# EAGLE design triaki samodzielne mniejsze_ver.4 (EAGLE 7.6.0)
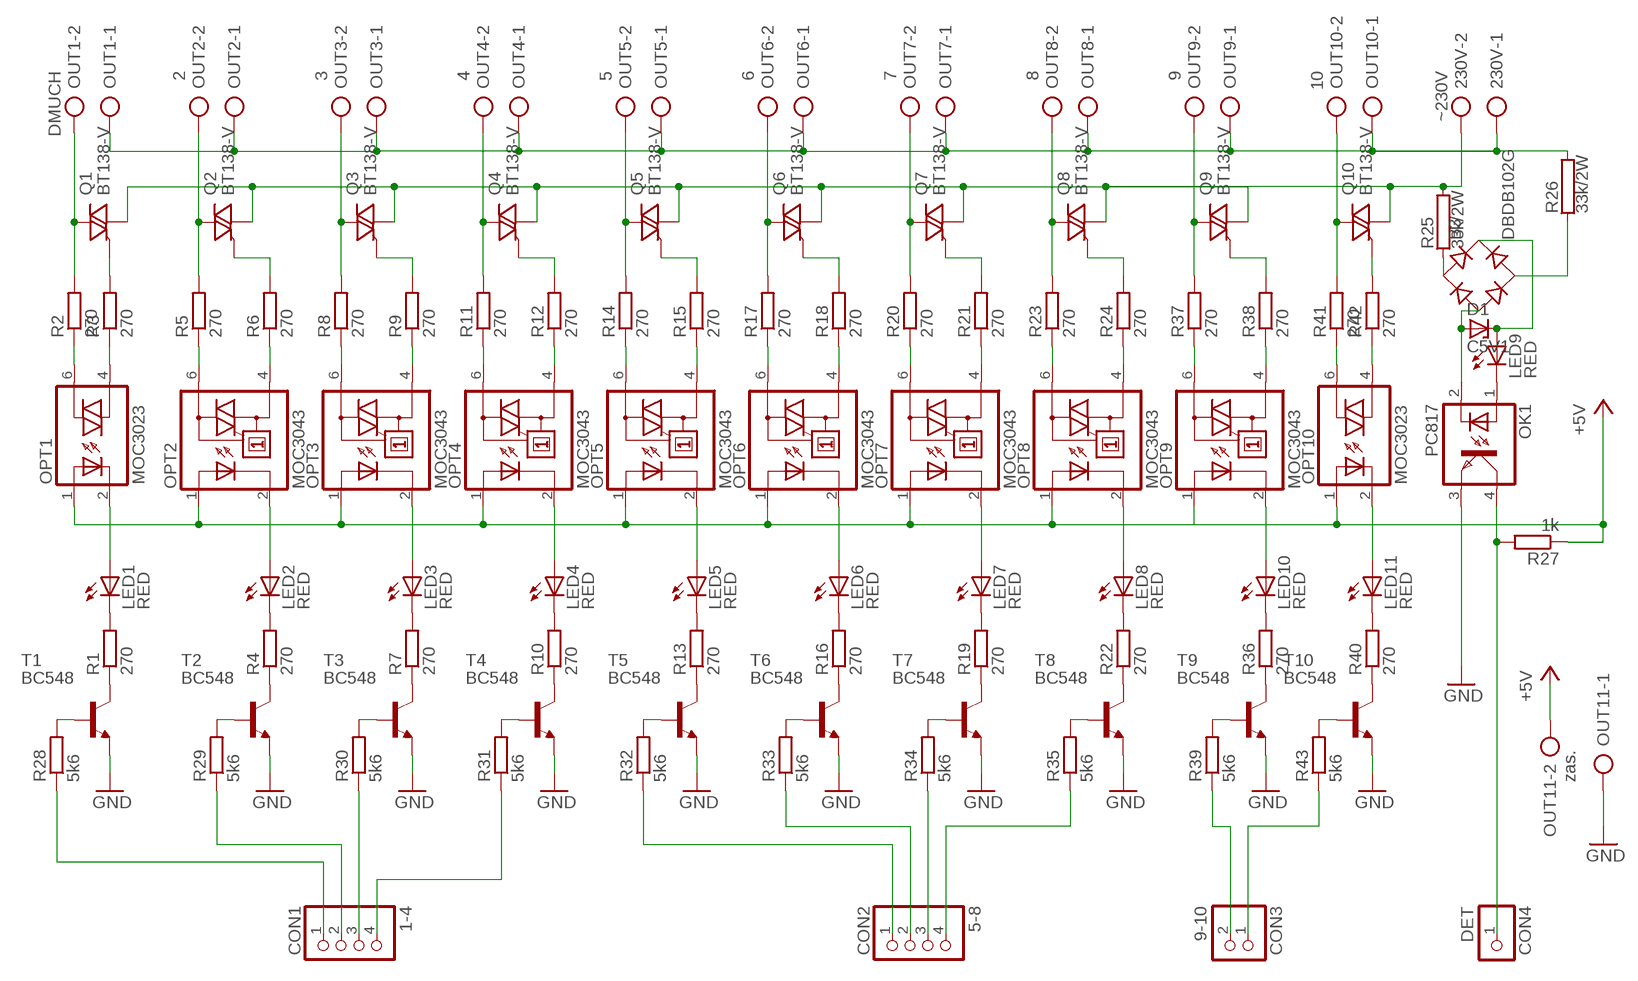
[diagram p0: schematic, sheet 1]

## Parts
230V  ~230V  AK500/2  [AK500/2]
B3  DBDB102G  [DB]
CON1  1-4  PINHD-1X4  [1X04]
CON2  5-8  PINHD-1X4  [1X04]
CON3  9-10  PINHD-1X2  [1X02]
CON4  DET  PINHD-1X1  [1X01]
D1  C5V1  BZX55  [DO35Z10]
LED1  RED  LED3MM  [LED3MM]
LED2  RED  LED3MM  [LED3MM]
LED3  RED  LED3MM  [LED3MM]
LED4  RED  LED3MM  [LED3MM]
LED5  RED  LED3MM  [LED3MM]
LED6  RED  LED3MM  [LED3MM]
LED7  RED  LED3MM  [LED3MM]
LED8  RED  LED3MM  [LED3MM]
LED9  RED  LED3MM  [LED3MM]
LED10  RED  LED3MM  [LED3MM]
LED11  RED  LED3MM  [LED3MM]
OK1  PC817  [DIL04]
OPT1  MOC3023  IL420  [DIL06]
OPT2  MOC3043  IL410  [DIL06]
OPT3  MOC3043  IL410  [DIL06]
OPT4  MOC3043  IL410  [DIL06]
OPT5  MOC3043  IL410  [DIL06]
OPT6  MOC3043  IL410  [DIL06]
OPT7  MOC3043  IL410  [DIL06]
OPT8  MOC3043  IL410  [DIL06]
OPT9  MOC3043  IL410  [DIL06]
OPT10  MOC3023  IL420  [DIL06]
OUT1  DMUCH  AK500/2  [AK500/2]
OUT2  2  AK500/2  [AK500/2]
OUT3  3  AK500/2  [AK500/2]
OUT4  4  AK500/2  [AK500/2]
OUT5  5  AK500/2  [AK500/2]
OUT6  6  AK500/2  [AK500/2]
OUT7  7  AK500/2  [AK500/2]
OUT8  8  AK500/2  [AK500/2]
OUT9  9  AK500/2  [AK500/2]
OUT10  10  AK500/2  [AK500/2]
OUT11  zas.  AK500/2  [AK500/2]
Q1  BT138-V  [TO220BV]
Q2  BT138-V  [TO220BV]
Q3  BT138-V  [TO220BV]
Q4  BT138-V  [TO220BV]
Q5  BT138-V  [TO220BV]
Q6  BT138-V  [TO220BV]
Q7  BT138-V  [TO220BV]
Q8  BT138-V  [TO220BV]
Q9  BT138-V  [TO220BV]
Q10  BT138-V  [TO220BV]
R1  270  R-EU_0204/7  [0204/7]
R2  270  R-EU_0204/7  [0204/7]
R3  270  R-EU_0204/7  [0204/7]
R4  270  R-EU_0204/7  [0204/7]
R5  270  R-EU_0204/7  [0204/7]
R6  270  R-EU_0204/7  [0204/7]
R7  270  R-EU_0204/7  [0204/7]
R8  270  R-EU_0204/7  [0204/7]
R9  270  R-EU_0204/7  [0204/7]
R10  270  R-EU_0204/7  [0204/7]
R11  270  R-EU_0204/7  [0204/7]
R12  270  R-EU_0204/7  [0204/7]
R13  270  R-EU_0204/7  [0204/7]
R14  270  R-EU_0204/7  [0204/7]
R15  270  R-EU_0204/7  [0204/7]
R16  270  R-EU_0204/7  [0204/7]
R17  270  R-EU_0204/7  [0204/7]
R18  270  R-EU_0204/7  [0204/7]
R19  270  R-EU_0204/7  [0204/7]
R20  270  R-EU_0204/7  [0204/7]
R21  270  R-EU_0204/7  [0204/7]
R22  270  R-EU_0204/7  [0204/7]
R23  270  R-EU_0204/7  [0204/7]
R24  270  R-EU_0204/7  [0204/7]
R25  33k/2W  RAC01  [AC01]
R26  33k/2W  RAC01  [AC01]
R27  1k  R-EU_0204/7  [0204/7]
R28  5k6  R-EU_0204/7  [0204/7]
R29  5k6  R-EU_0204/7  [0204/7]
R30  5k6  R-EU_0204/7  [0204/7]
R31  5k6  R-EU_0204/7  [0204/7]
R32  5k6  R-EU_0204/7  [0204/7]
R33  5k6  R-EU_0204/7  [0204/7]
R34  5k6  R-EU_0204/7  [0204/7]
R35  5k6  R-EU_0204/7  [0204/7]
R36  270  R-EU_0204/7  [0204/7]
R37  270  R-EU_0204/7  [0204/7]
R38  270  R-EU_0204/7  [0204/7]
R39  5k6  R-EU_0204/7  [0204/7]
R40  270  R-EU_0204/7  [0204/7]
R41  270  R-EU_0204/7  [0204/7]
R42  270  R-EU_0204/7  [0204/7]
R43  5k6  R-EU_0204/7  [0204/7]
T1  BC548  BC548-NPN-TO92-CBE  [TO92-CBE]
T2  BC548  BC548-NPN-TO92-CBE  [TO92-CBE]
T3  BC548  BC548-NPN-TO92-CBE  [TO92-CBE]
T4  BC548  BC548-NPN-TO92-CBE  [TO92-CBE]
T5  BC548  BC548-NPN-TO92-CBE  [TO92-CBE]
T6  BC548  BC548-NPN-TO92-CBE  [TO92-CBE]
T7  BC548  BC548-NPN-TO92-CBE  [TO92-CBE]
T8  BC548  BC548-NPN-TO92-CBE  [TO92-CBE]
T9  BC548  BC548-NPN-TO92-CBE  [TO92-CBE]
T10  BC548  BC548-NPN-TO92-CBE  [TO92-CBE]

## Nets
+5V: OPT1.1(A) OPT2.1(A) OPT3.1(A) OPT4.1(A) OPT5.1(A) OPT6.1(A) OPT7.1(A) OPT8.1(A) OPT10.1(A) OUT11.2 R27.1
+5V1: OPT9.1(A)
GND: OK1.3(EMIT) OUT11.1 T1.E T2.E T3.E T4.E T5.E T6.E T7.E T8.E T9.E T10.E
N$1: OPT1.6(A2) R2.1
N$2: OPT1.4(A1) R3.1
N$3: LED1.K(C) R1.2
N$4: LED1.A OPT1.2(C)
N$5: Q1.G R3.2
N$6: OUT1.2 Q1.T2(A2) R2.2
N$7: LED2.K(C) R4.2
N$8: OPT2.6(A2) R5.1
N$10: Q2.G R6.2
N$11: OPT2.4(A1) R6.1
N$12: Q9.T1(A1)
N$13: 230V.1 OUT1.1 OUT2.1 OUT3.1 OUT4.1 OUT5.1 OUT6.1 OUT7.1 OUT8.1 OUT9.1 OUT10.1 R26.2
N$14: LED2.A OPT2.2(C)
N$15: LED3.K(C) R7.2
N$16: LED4.K(C) R10.2
N$17: OPT3.6(A2) R8.1
N$18: OUT3.2 Q3.T2(A2) R8.2
N$19: Q3.G R9.2
N$20: OPT3.4(A1) R9.1
N$21: LED9.K(C) OK1.1(A)
N$22: LED5.K(C) R13.2
N$23: LED3.A OPT3.2(C)
N$24: LED6.K(C) R16.2
N$25: LED7.K(C) R19.2
N$26: OPT4.6(A2) R11.1
N$27: OUT4.2 Q4.T2(A2) R11.2
N$28: Q4.G R12.2
N$29: OPT4.4(A1) R12.1
N$30: LED8.K(C) R22.2
N$31: R1.1 T1.C
N$32: LED4.A OPT4.2(C)
N$33: R28.2 T1.B
N$34: R4.1 T2.C
N$35: OPT5.6(A2) R14.1
N$36: OUT5.2 Q5.T2(A2) R14.2
N$37: Q5.G R15.2
N$38: OPT5.4(A1) R15.1
N$39: R7.1 T3.C
N$40: R10.1 T4.C
N$41: LED5.A OPT5.2(C)
N$42: B3.+ D1.C LED9.A
N$43: R13.1 T5.C
N$44: OPT6.6(A2) R17.1
N$45: OUT6.2 Q6.T2(A2) R17.2
N$46: Q6.G R18.2
N$47: OPT6.4(A1) R18.1
N$48: B3.AC1 R25.1
N$49: B3.AC2 R26.1
N$50: LED6.A OPT6.2(C)
N$51: R16.1 T6.C
N$52: R19.1 T7.C
N$53: OPT7.6(A2) R20.1
N$54: OUT7.2 Q7.T2(A2) R20.2
N$55: Q7.G R21.2
N$56: OPT7.4(A1) R21.1
N$57: R22.1 T8.C
N$58: B3.- D1.A OK1.2(C)
N$59: LED7.A OPT7.2(C)
N$60: CON3.1 R43.1
N$61: R35.2 T8.B
N$62: OPT8.6(A2) R23.1
N$63: OUT8.2 Q8.T2(A2) R23.2
N$64: Q8.G R24.2
N$65: OPT8.4(A1) R24.1
N$66: R34.2 T7.B
N$67: R33.2 T6.B
N$68: LED8.A OPT8.2(C)
N$69: R32.2 T5.B
N$70: R31.2 T4.B
N$71: R30.2 T3.B
N$72: R29.2 T2.B
N$73: CON1.4 R31.1
N$74: CON1.3 R30.1
N$75: CON1.2 R29.1
N$76: CON1.1 R28.1
N$77: CON2.4 R35.1
N$78: CON2.3 R34.1
N$79: CON2.2 R33.1
N$80: CON2.1 R32.1
N$81: OPT9.6(A2) R37.1
N$82: OUT9.2 Q9.T2(A2) R37.2
N$83: Q9.G R38.2
N$84: 230V.2 Q1.T1(A1) Q2.T1(A1) Q3.T1(A1) Q4.T1(A1) Q5.T1(A1) Q6.T1(A1) Q7.T1(A1) Q8.T1(A1) Q10.T1(A1) R25.2
N$87: OPT9.4(A1) R38.1
N$88: LED10.A OPT9.2(C)
N$90: LED10.K(C) R36.2
N$91: R36.1 T9.C
N$92: R39.2 T9.B
N$93: CON3.2 R39.1
N$94: OPT10.6(A2) R41.1
N$95: OPT10.4(A1) R42.1
N$96: LED11.A OPT10.2(C)
N$97: Q10.G R42.2
N$98: OUT10.2 Q10.T2(A2) R41.2
N$99: CON4.1 OK1.4(COL) R27.2
N$101: LED11.K(C) R40.2
N$102: R40.1 T10.C
N$103: R43.2 T10.B
N$106: OUT2.2 Q2.T2(A2) R5.2

## Library data of the parts
230V OUT1-OUT11 = con-ptr500:AK500/2: CONNECTOR; OC_FARNELL: unknown; OC_NEWARK: unknown
B3 = rectifier:DB?*G: Single Phase 1.0 AMP Glass Passivated Bridge Rectifier Taiwan Semiconductor Co.,Ltd. - TSC Source: http://www.taiwansemi.com/TSCbig5/ezcatfiles/cust/img/img/db101g.pdf http://www.ts.com.tw/db/pictures/modules/PDT/PDT060207001/DBLS201G.pdf
CON1 CON2 = pinhead:PINHD-1X4: PIN HEADER
CON3 = pinhead:PINHD-1X2: PIN HEADER
CON4 = pinhead:PINHD-1X1: PIN HEADER
D1 = diode:BZX55: Z DIODE
LED1-LED11 = led:LED: LED OSRAM: - CHIPLED LG R971, LG N971, LY N971, LG Q971, LY Q971, LO R971, LY R971 LH N974, LH R974 LS Q976, LO Q976, LY Q976 LO Q996 - Hyper CHIPLED LW Q18S LB Q993, LB Q99A, LB R99A - SideLED LS A670, LO A670, LY A670, LG A670, LP A670 LB A673, LV A673, LT A673, LW A673 LH A674 LY A675 LS A676, LA A676, LO A676, LY A676, LW A676 LS A679, LY A679, LG A679 - Hyper Micro SIDELED® LS Y876, LA Y876, LO Y876, LY Y876 LT Y87S - SmartLED LW L88C, LW L88S LB L89C, LB L89S, LG L890 LS L89K, LO L89K, LY L89K LS L896, LA L896, LO L896, LY L896 - TOPLED LS T670, LO T670, LY T670, LG T670, LP T670 LSG T670, LSP T670, LSY T670, LOP T670, LYG T670 LG T671, LOG T671, LSG T671 LB T673, LV T673, LT T673, LW T673 LH T674 LS T676, LA T676, LO T676, LY T676, LB T676, LH T676, LSB T676, LW T676 LB T67C, LV T67C, LT T67C, LS T67K, LO T67K, LY T67K, LW E67C LS E67B, LA E67B, LO E67B, LY E67B, LB E67C, LV E67C, LT E67C LW T67C LS T679, LY T679, LG T679 LS T770, LO T770, LY T770, LG T770, LP T770 LB T773, LV T773, LT T773, LW T773 LH T774 LS E675, LA E675, LY E675, LS T675 LS T776, LA T776, LO T776, LY T776, LB T776 LHGB T686 LT T68C, LB T68C - Hyper Mini TOPLED® LB M676 - Mini TOPLED Santana® LG M470 LS M47K, LO M47K, LY M47K Source: http://www.osram.convergy.de LUXEON: - LUMILED® LXK2-PW12-R00, LXK2-PW12-S00, LXK2-PW14-U00, LXK2-PW14-V00 LXK2-PM12-R00, LXK2-PM12-S00, LXK2-PM14-U00 LXK2-PE12-Q00, LXK2-PE12-R00, LXK2-PE12-S00, LXK2-PE14-T00, LXK2-PE14-U00 LXK2-PB12-K00, LXK2-PB12-L00, LXK2-PB12-M00, LXK2-PB14-N00, LXK2-PB14-P00, LXK2-PB14-Q00 LXK2-PR12-L00, LXK2-PR12-M00, LXK2-PR14-Q00, LXK2-PR14-R00 LXK2-PD12-Q00, LXK2-PD12-R00, LXK2-PD12-S00 LXK2-PH12-R00, LXK2-PH12-S00 LXK2-PL12-P00, LXK2-PL12-Q00, LXK2-PL12-R00 Source: www.luxeon.com KINGBRIGHT: KA-3528ASYC Source: www.kingbright.com
OK1 = optocoupler:PC817: SHARP OPTO COUPLER; MPN: PC817X4J000F; OC_FARNELL: 9707727; OC_NEWARK: 97K7059
OPT1 OPT10 = optocoupler:IL420: SIEMENS OPTO COUPLER; MF: FAIRCHILD SEMICONDUCTOR; MPN: MOC3021; OC_FARNELL: 1469561; OC_NEWARK: 58K1719
OPT2-OPT9 = optocoupler:IL410: SIEMENS OPTO COUPLER; MF: FAIRCHILD SEMICONDUCTOR; MPN: MOC3041; OC_FARNELL: 1045434; OC_NEWARK: 58K1715
Q1-Q10 = triac:BT138: TRIAC Source: http://www.semiconductors.philips.com BT138_SERIES_2.pdf
R1-R24 R27-R43 = rcl:R-EU_: RESISTOR, European symbol
R25 R26 = resistor-power:R: Power Resitor; OC_FARNELL: unknown; OC_NEWARK: unknown
T1-T10 = transistor:*-NPN-: NPN Transistror BF959 corrected 2008.03.06

## Board
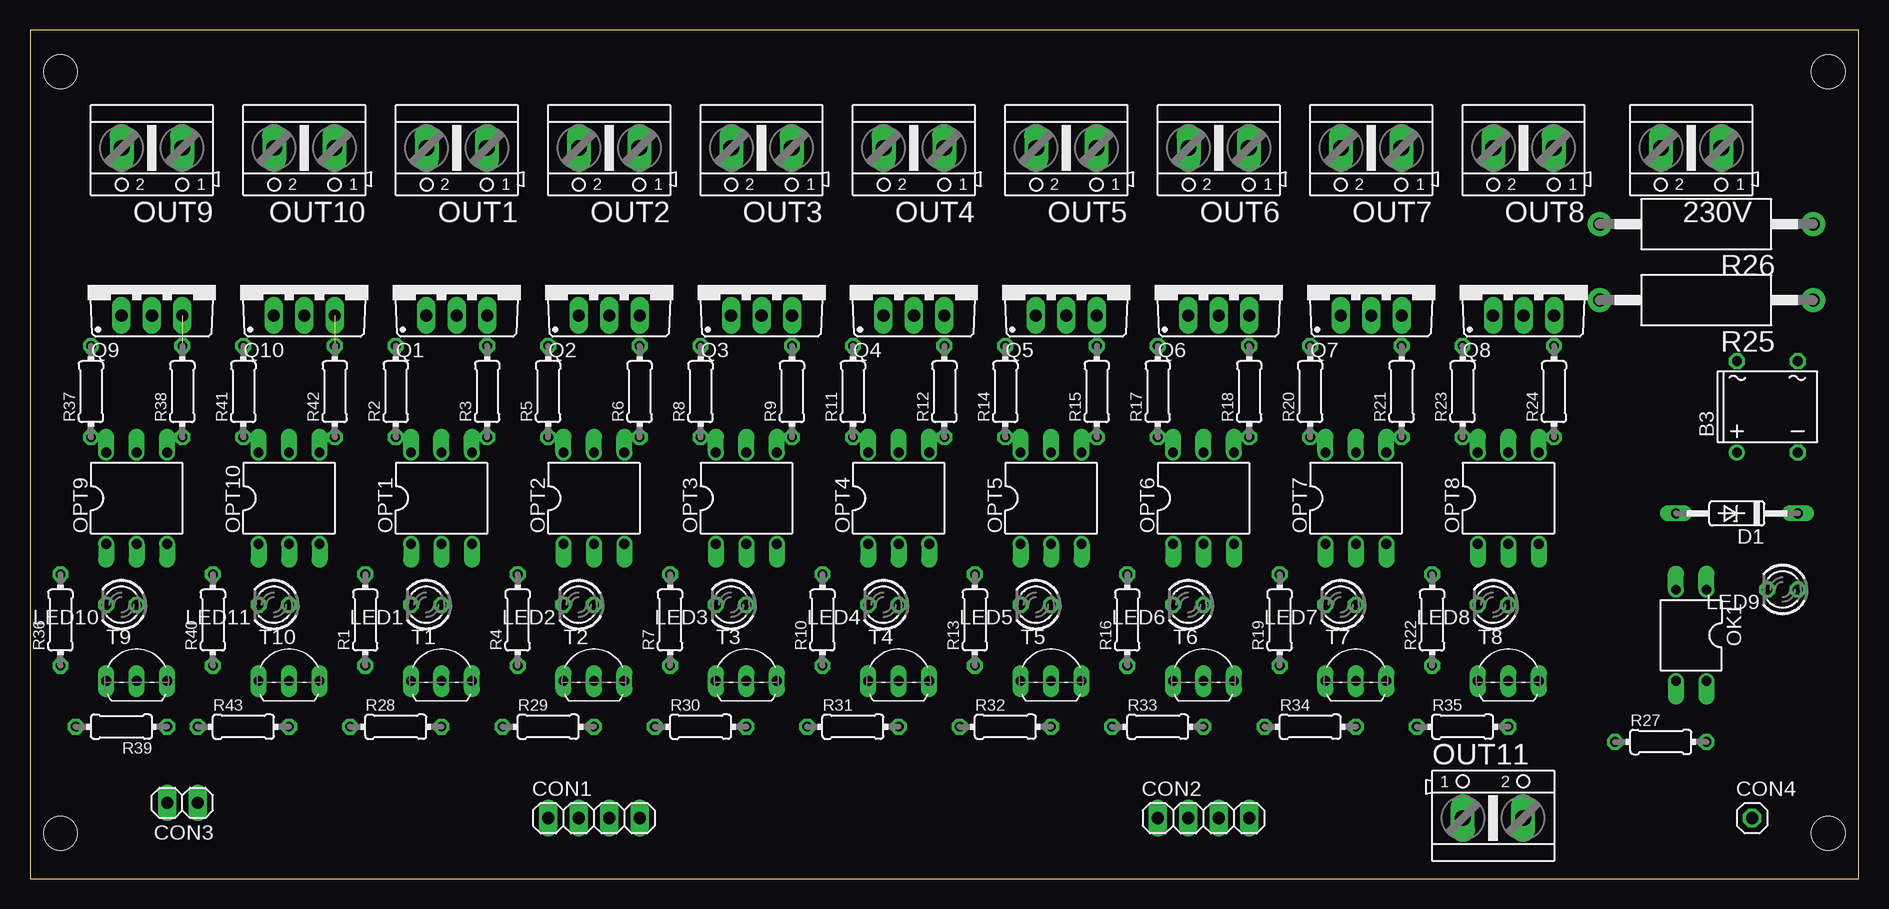
[diagram p1: board, top side]
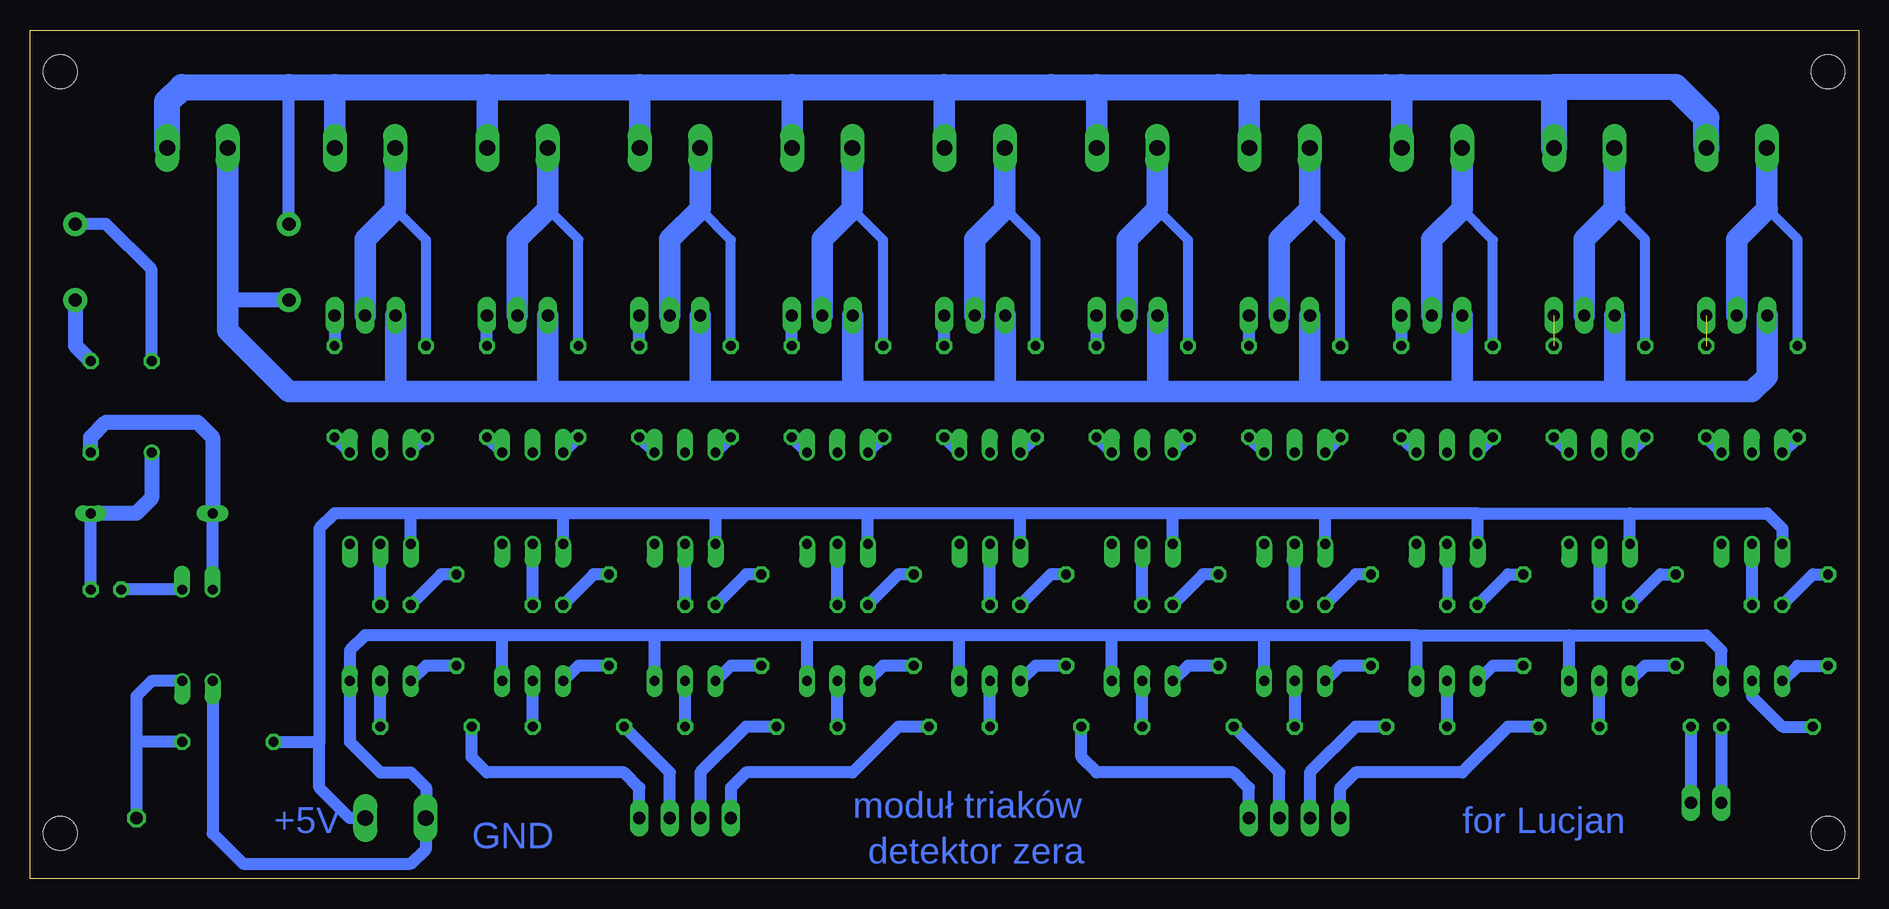
[diagram p2: board, bottom side, seen from below]

Size 152.38 x 70.79 mm. Coordinates in mm from the lower left corner, seen from the top.
Outline: 0,0 152.38,0 152.38,70.79 0,70.79 0,0
Copper layers (1*16): Top 0.035mm / dielectric 1.5mm / Bottom 0.035mm
Design rules "default": minimum track width 10mil, minimum drill 24mil, track to track 8mil, track to pad 8mil, pad to pad 8mil, via to via 8mil, smd to smd 8mil, copper to edge 40mil, drill to drill 8mil, minimum pad ring 10mil, minimum via ring 8mil, stop-mask expansion 4mil, vias tented up to drill 0mil, thermal gap 10mil
Holes 2.8 mm at 149.86,3.81 2.54,3.81 2.54,67.31 149.86,67.31

### Footprints (pad centres in the part's own frame; a part is rotated, then mirrored left to right if it is on the bottom)
AK500/2 = drill 1.321 long: 1 -2.515,0; 2 2.515,0
DB = drill 0.813: + -2.54,-3.81 | drill 0.813 octagon: - 2.54,-3.81; AC1 2.54,3.81; AC2 -2.54,3.81
1X04 = drill 1.016 long: 1 -3.81,0; 2 -1.27,0; 3 1.27,0; 4 3.81,0
1X02 = drill 1.016 long: 1 -1.27,0; 2 1.27,0
1X01 = drill 1.016 octagon: 1 0,0
DO35Z10 = drill 0.813 long: A 5.08,0; C -5.08,0
LED3MM = drill 0.813 octagon: A -1.27,0; K 1.27,0
DIL04 = drill 0.813 offset: 1 -1.27,-3.81; 2 1.27,-3.81; 3 1.27,3.81; 4 -1.27,3.81
DIL06 = drill 0.813 offset: 1 -2.54,-3.81; 2 0,-3.81; 3 2.54,-3.81; 4 2.54,3.81; 5 0,3.81; 6 -2.54,3.81
TO220BV = drill 1.016 long: G 2.54,-2.54; T1 -2.54,-2.54; T2 0,-2.54
0204/7 = drill 0.813 octagon: 1 -3.81,0; 2 3.81,0
AC01 = drill 1.1 pad 2: 1 -8.9,0; 2 8.9,0
TO92-CBE = drill 0.813 long: B 0,0; C -2.54,0; E 2.54,0

### Placement (x,y rotation side)
230V  138.43,60.96 180 top
B3  144.78,39.37 0 top
CON1  46.99,5.08 0 top
CON2  97.79,5.08 0 top
CON3  12.7,6.35 180 top
CON4  143.51,5.08 0 top
D1  142.24,30.48 180 top
LED1  33.02,22.86 180 top
LED2  45.72,22.86 180 top
LED3  58.42,22.86 180 top
LED4  71.12,22.86 180 top
LED5  83.82,22.86 180 top
LED6  96.52,22.86 180 top
LED7  109.22,22.86 180 top
LED8  121.92,22.86 180 top
LED9  146.05,24.13 180 top
LED10  7.62,22.86 180 top
LED11  20.32,22.86 180 top
OK1  138.43,20.32 180 top
OPT1  34.29,31.75 0 top
OPT2  46.99,31.75 0 top
OPT3  59.69,31.75 0 top
OPT4  72.39,31.75 0 top
OPT5  85.09,31.75 0 top
OPT6  97.79,31.75 0 top
OPT7  110.49,31.75 0 top
OPT8  123.19,31.75 0 top
OPT9  8.89,31.75 0 top
OPT10  21.59,31.75 0 top
OUT1  35.56,60.96 180 top
OUT2  48.26,60.96 180 top
OUT3  60.96,60.96 180 top
OUT4  73.66,60.96 180 top
OUT5  86.36,60.96 180 top
OUT6  99.06,60.96 180 top
OUT7  111.76,60.96 180 top
OUT8  124.46,60.96 180 top
OUT9  10.16,60.96 180 top
OUT10  22.86,60.96 180 top
OUT11  121.92,5.08 0 top
Q1  35.56,49.53 0 top
Q2  48.26,49.53 0 top
Q3  60.96,49.53 0 top
Q4  73.66,49.53 0 top
Q5  86.36,49.53 0 top
Q6  99.06,49.53 0 top
Q7  111.76,49.53 0 top
Q8  124.46,49.53 0 top
Q9  10.16,49.53 0 top
Q10  22.86,49.53 0 top
R1  27.94,21.59 90 top
R2  30.48,40.64 90 top
R3  38.1,40.64 90 top
R4  40.64,21.59 90 top
R5  43.18,40.64 90 top
R6  50.8,40.64 90 top
R7  53.34,21.59 90 top
R8  55.88,40.64 90 top
R9  63.5,40.64 90 top
R10  66.04,21.59 90 top
R11  68.58,40.64 90 top
R12  76.2,40.64 90 top
R13  78.74,21.59 90 top
R14  81.28,40.64 90 top
R15  88.9,40.64 90 top
R16  91.44,21.59 90 top
R17  93.98,40.64 90 top
R18  101.6,40.64 90 top
R19  104.14,21.59 90 top
R20  106.68,40.64 90 top
R21  114.3,40.64 90 top
R22  116.84,21.59 90 top
R23  119.38,40.64 90 top
R24  127,40.64 90 top
R25  139.7,48.26 180 top
R26  139.7,54.61 180 top
R27  135.89,11.43 0 top
R28  30.48,12.7 0 top
R29  43.18,12.7 0 top
R30  55.88,12.7 0 top
R31  68.58,12.7 0 top
R32  81.28,12.7 0 top
R33  93.98,12.7 0 top
R34  106.68,12.7 0 top
R35  119.38,12.7 0 top
R36  2.54,21.59 90 top
R37  5.08,40.64 90 top
R38  12.7,40.64 90 top
R39  7.62,12.7 180 top
R40  15.24,21.59 90 top
R41  17.78,40.64 90 top
R42  25.4,40.64 90 top
R43  17.78,12.7 0 top
T1  34.29,16.51 0 top
T2  46.99,16.51 0 top
T3  59.69,16.51 0 top
T4  72.39,16.51 0 top
T5  85.09,16.51 0 top
T6  97.79,16.51 0 top
T7  110.49,16.51 0 top
T8  123.19,16.51 0 top
T9  8.89,16.51 0 top
T10  21.59,16.51 0 top

### Tracks (layer width: path | path; a pad name or v marks a point on that pad's centre or on a via)
+5V
  Bottom 1.016: OPT1.1 31.75,30.48 | 31.75,30.48 44.45,30.48 | OPT2.1 44.45,30.48 | 44.45,30.48 57.15,30.48 | OPT3.1 57.15,30.48 | 57.15,30.48 69.85,30.48 | 69.85,30.48 82.55,30.48 | 82.55,30.48 95.25,30.48 | 95.25,30.48 107.95,30.48 | 107.95,30.48 120.65,30.48 | OPT7.1 107.95,30.48 | OPT6.1 95.25,30.48 | OPT5.1 82.55,30.48 | OPT4.1 69.85,30.48 | OPT8.1 120.65,30.48 | 31.75,30.48 19.05,30.48 | 19.05,30.48 7.62,30.48 6.35,29.21 6.35,27.94 | OPT10.1 19.05,30.48 | 120.65,30.48 127,30.48 128.27,29.21 128.27,11.43 | R27.1 128.27,11.43 | OUT11.2 125.73,5.08 128.27,7.62 128.27,11.43
GND
  Bottom 1.016: 36.83,20.32 49.53,20.32 | 49.53,20.32 62.23,20.32 | 62.23,20.32 74.93,20.32 | 74.93,20.32 87.63,20.32 | 87.63,20.32 100.33,20.32 | 100.33,20.32 113.03,20.32 | T1.E 36.83,20.32 | 36.83,20.32 24.13,20.32 | 24.13,20.32 12.7,20.32 11.43,19.05 T9.E | T2.E 49.53,20.32 | T3.E 62.23,20.32 | T4.E 74.93,20.32 | T5.E 87.63,20.32 | T6.E 100.33,20.32 | T7.E 113.03,20.32 | 113.03,20.32 124.46,20.32 125.73,19.05 T8.E 125.73,11.43 123.19,8.89 120.65,8.89 119.38,7.62 119.38,5.1 OUT11.1 119.38,5.08 119.38,2.54 120.65,1.27 134.62,1.27 137.16,3.81 OK1.3 | T10.E 24.13,20.32
N$1
  Bottom 1.016: R2.1 OPT1.6
N$2
  Bottom 1.016: OPT1.4 R3.1
N$3
  Bottom 1.016: LED1.K 29.21,25.4 R1.2
N$4
  Bottom 0.813: OPT1.2 LED1.A
N$5
  Bottom 1.016: Q1.G R3.2
N$6
  Bottom 0.813: R2.2 30.48,53.29 33.05,55.86
  Bottom 1.778: OUT1.2 33.05,55.86 35.56,53.34 Q1.T2
N$7
  Bottom 1.016: R4.2 41.91,25.4 LED2.K
N$8
  Bottom 1.016: R5.1 OPT2.6
N$10
  Bottom 1.016: Q2.G R6.2
N$11
  Bottom 1.016: OPT2.4 R6.1
N$13
  Bottom 1.016: R26.2 130.8,66.03 130.81,66.04
  Bottom 1.778: OUT1.1 38.08,66.02 38.1,66.04 | OUT2.1 50.77,66.02 50.8,66.04 | OUT3.1 63.48,66.02 63.5,66.04 | OUT4.1 76.17,66.02 76.2,66.04 | OUT5.1 88.88,66.02 88.9,66.04 | OUT6.1 101.57,66.02 101.6,66.04 | OUT7.1 114.28,66.02 114.3,66.04 | OUT8.1 126.97,66.02 127,66.04
  Bottom 2.184: 53.34,66.04 50.8,66.04 39.37,66.04 | 39.37,66.04 38.1,66.04 25.4,66.04 | 67.31,66.04 63.5,66.04 53.34,66.04 | 109.22,66.04 101.6,66.04 88.9,66.04 76.2,66.04 67.31,66.04 | 109.22,66.04 114.3,66.04 127,66.04 130.81,66.04 139.7,66.04 140.94,64.8 230V.1 | 53.31,66.02 53.34,66.04 | 67.28,66.02 67.31,66.04 | 109.19,66.02 109.22,66.04 | 39.34,66.02 39.37,66.04 | OUT10.1 25.38,66.02 25.4,66.04 | OUT9.1 12.67,63.47 15.24,66.04 25.4,66.04
N$14
  Bottom 1.016: LED2.A OPT2.2
N$15
  Bottom 1.016: R7.2 54.61,25.4 LED3.K
N$16
  Bottom 1.016: R10.2 67.31,25.4 LED4.K
N$17
  Bottom 1.016: R8.1 OPT3.6
N$18
  Bottom 0.813: R8.2 55.88,53.29 58.45,55.86
  Bottom 1.778: OUT3.2 58.45,55.86 60.96,53.34 Q3.T2
N$19
  Bottom 1.016: R9.2 Q3.G
N$20
  Bottom 1.016: OPT3.4 R9.1
N$21
  Bottom 1.016: OK1.1 LED9.K
N$22
  Bottom 1.016: R13.2 80.01,25.4 LED5.K
N$23
  Bottom 1.016: LED3.A OPT3.2
N$24
  Bottom 1.016: R16.2 92.71,25.4 LED6.K
N$25
  Bottom 1.016: R19.2 105.41,25.4 LED7.K
N$26
  Bottom 1.016: R11.1 OPT4.6
N$27
  Bottom 0.813: R11.2 68.58,53.34 71.12,55.88 71.14,55.86
  Bottom 1.778: OUT4.2 71.14,55.86 73.66,53.34 Q4.T2
N$28
  Bottom 1.016: R12.2 Q4.G
N$29
  Bottom 1.016: OPT4.4 R12.1
N$30
  Bottom 1.016: R22.2 118.11,25.4 LED8.K
N$31
  Bottom 1.016: R1.1 30.48,17.78 T1.C
N$32
  Bottom 1.016: LED4.A OPT4.2
N$33
  Bottom 1.016: R28.2 T1.B
N$34
  Bottom 1.016: R4.1 43.18,17.78 T2.C
N$35
  Bottom 1.016: R14.1 OPT5.6
N$36
  Bottom 0.813: R14.2 81.28,53.29 83.84,55.86
  Bottom 1.778: OUT5.2 83.84,55.86 86.36,53.34 Q5.T2
N$37
  Bottom 1.016: R15.2 Q5.G
N$38
  Bottom 1.016: OPT5.4 R15.1
N$39
  Bottom 1.016: R7.1 55.88,17.78 T3.C
N$40
  Bottom 1.016: R10.1 68.58,17.78 T4.C
N$41
  Bottom 1.016: LED5.A OPT5.2
N$42
  Bottom 1.016: LED9.A D1.C
  Bottom 1.27: B3.+ 142.24,31.75 143.51,30.48 D1.C
N$43
  Bottom 1.016: R13.1 81.28,17.78 T5.C
N$44
  Bottom 1.016: R17.1 OPT6.6
N$45
  Bottom 0.813: R17.2 93.98,53.29 96.54,55.86
  Bottom 1.778: OUT6.2 96.54,55.86 99.06,53.34 Q6.T2
N$46
  Bottom 1.016: R18.2 Q6.G
N$47
  Bottom 1.016: OPT6.4 R18.1
N$48
  Bottom 1.27: R25.1 148.6,44.46 B3.AC1
N$49
  Bottom 1.016: B3.AC2 142.24,50.8 146.05,54.61 R26.1
N$50
  Bottom 1.016: LED6.A OPT6.2
N$51
  Bottom 1.016: R16.1 93.98,17.78 T6.C
N$52
  Bottom 1.016: R19.1 106.68,17.78 T7.C
N$53
  Bottom 1.016: R20.1 OPT7.6
N$54
  Bottom 0.813: R20.2 106.68,53.34 109.22,55.88 109.25,55.86
  Bottom 1.778: OUT7.2 109.25,55.86 111.76,53.34 Q7.T2
N$55
  Bottom 1.016: R21.2 Q7.G
N$56
  Bottom 1.016: OPT7.4 R21.1
N$57
  Bottom 1.016: R22.1 119.38,17.78 T8.C
N$58
  Bottom 1.016: 137.38,30.7 D1.A OK1.2
  Bottom 1.27: B3.- 147.32,36.83 146.05,38.1 138.43,38.1 137.16,36.83 D1.A
N$59
  Bottom 1.016: LED7.A OPT7.2
N$60
  Bottom 1.016: R43.1 CON3.1
N$61
  Bottom 1.016: R35.2 T8.B
N$62
  Bottom 0.813: R23.1 OPT8.6
N$63
  Bottom 0.813: R23.2 119.38,53.29 121.94,55.86
  Bottom 1.778: OUT8.2 121.94,55.86 124.46,53.34 Q8.T2
N$64
  Bottom 1.016: Q8.G R24.2
N$65
  Bottom 1.016: OPT8.4 R24.1
N$66
  Bottom 1.016: R34.2 T7.B
N$67
  Bottom 1.016: R33.2 T6.B
N$68
  Bottom 1.016: LED8.A OPT8.2
N$69
  Bottom 1.016: R32.2 T5.B
N$70
  Bottom 1.016: R31.2 T4.B
N$71
  Bottom 1.016: R30.2 T3.B
N$72
  Bottom 1.016: T2.B R29.2
N$73
  Bottom 1.016: CON1.4 50.8,7.62 52.07,8.89 63.5,8.89 64.77,10.16 R31.1
N$74
  Bottom 1.016: CON1.3 48.26,8.89 R30.1
N$75
  Bottom 1.016: R29.1 41.91,12.7 45.72,8.89 CON1.2
N$76
  Bottom 1.016: CON1.1 43.18,7.62 41.91,8.89 33.02,8.89 29.21,12.7 R28.1
N$77
  Bottom 1.016: CON2.4 101.6,7.62 102.87,8.89 114.3,8.89 115.57,10.16 R35.1
N$78
  Bottom 1.016: CON2.3 99.06,8.89 R34.1
N$79
  Bottom 1.016: R33.1 92.71,12.7 96.52,8.89 CON2.2
N$80
  Bottom 1.016: R32.1 80.01,12.7 83.82,8.89 92.71,8.89 93.98,7.62 CON2.1
N$81
  Bottom 1.016: OPT9.6 R37.1
N$82
  Bottom 0.813: R37.2 5.08,53.34 7.62,55.88
  Bottom 1.778: OUT9.2 7.64,55.91 7.62,55.88 10.16,53.34 Q9.T2
N$83  (1 unrouted)
N$84
  Bottom 1.27: R25.2 135.91,48.26
  Bottom 1.778: 121.92,40.64 109.22,40.64 | 109.22,40.64 96.52,40.64 | 96.52,40.64 83.82,40.64 | 83.82,40.64 71.12,40.64 | 71.12,40.64 58.42,40.64 | 58.42,40.64 45.72,40.64 | 45.72,40.64 33.02,40.64 | Q1.T1 33.02,40.64 | Q2.T1 45.72,40.64 | Q3.T1 58.42,40.64 | Q4.T1 71.12,40.64 | Q5.T1 83.82,40.64 | Q6.T1 96.52,40.64 | Q7.T1 109.22,40.64 | Q8.T1 121.92,40.64 | 121.92,40.64 130.81,40.64 135.91,45.75 135.91,48.26 230V.2 | 33.02,40.64 20.32,40.64 | 20.32,40.64 8.89,40.64 7.62,41.91 7.62,46.99 | Q10.T1 20.32,40.64
N$87
  Bottom 1.016: OPT9.4 R38.1
N$88
  Bottom 1.016: OPT9.2 LED10.A
N$90
  Bottom 1.016: LED10.K 3.81,25.4 R36.2
N$91
  Bottom 1.016: T9.C 5.08,17.78 R36.1
N$92
  Bottom 1.016: T9.B 8.89,15.24 6.35,12.7 R39.2
N$93
  Bottom 1.016: R39.1 CON3.2
N$94
  Bottom 1.016: OPT10.6 R41.1
N$95
  Bottom 1.016: OPT10.4 R42.1
N$96
  Bottom 1.016: OPT10.2 LED11.A
N$97  (1 unrouted)
N$98
  Bottom 0.813: R41.2 17.78,53.34 20.32,55.88
  Bottom 1.778: OUT10.2 20.34,55.91 20.32,55.88 22.86,53.34 Q10.T2
N$99
  Bottom 1.016: OK1.4 142.24,16.51 143.51,15.24 143.51,11.43 | 143.51,11.43 CON4.1 | R27.2 143.51,11.43
N$101
  Bottom 1.016: LED11.K 16.51,25.4 R40.2
N$102
  Bottom 1.016: R40.1 17.78,17.78 T10.C
N$103
  Bottom 1.016: R43.2 T10.B
N$106
  Bottom 0.813: R5.2 43.18,53.34 45.72,55.88 45.74,55.86
  Bottom 1.778: OUT2.2 45.74,55.86 48.26,53.34 Q2.T2

### Text on the board
Bottom: moduł triaków | for Lucjan | +5V | GND | detektor zera